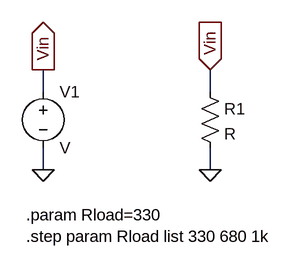
[diagram p0: schematic Draft2.asc]
Draft2.asc, the LTspice schematic file:
Version 4
SHEET 1 880 680
WIRE -336 -64 -336 -96
WIRE -96 -64 -96 -96
WIRE -336 48 -336 16
WIRE -96 48 -96 16
FLAG -336 48 0
FLAG -96 48 0
FLAG -336 -96 Vin
IOPIN -336 -96 Out
FLAG -96 -96 Vin
IOPIN -96 -96 In
SYMBOL voltage -336 -80 R0
SYMATTR InstName V1
SYMBOL res -112 -80 R0
SYMATTR InstName R1
TEXT -360 112 Left 2 !.param Rload=330\n.step param Rload list 330 680 1k

The netlist it stands for:
* Draft2.asc
V1 Vin 0 V
R1 Vin 0 R
.param Rload=330
.step param Rload list 330 680 1k
.backanno
.end